# EAGLE design psu (EAGLE 6.5.0)
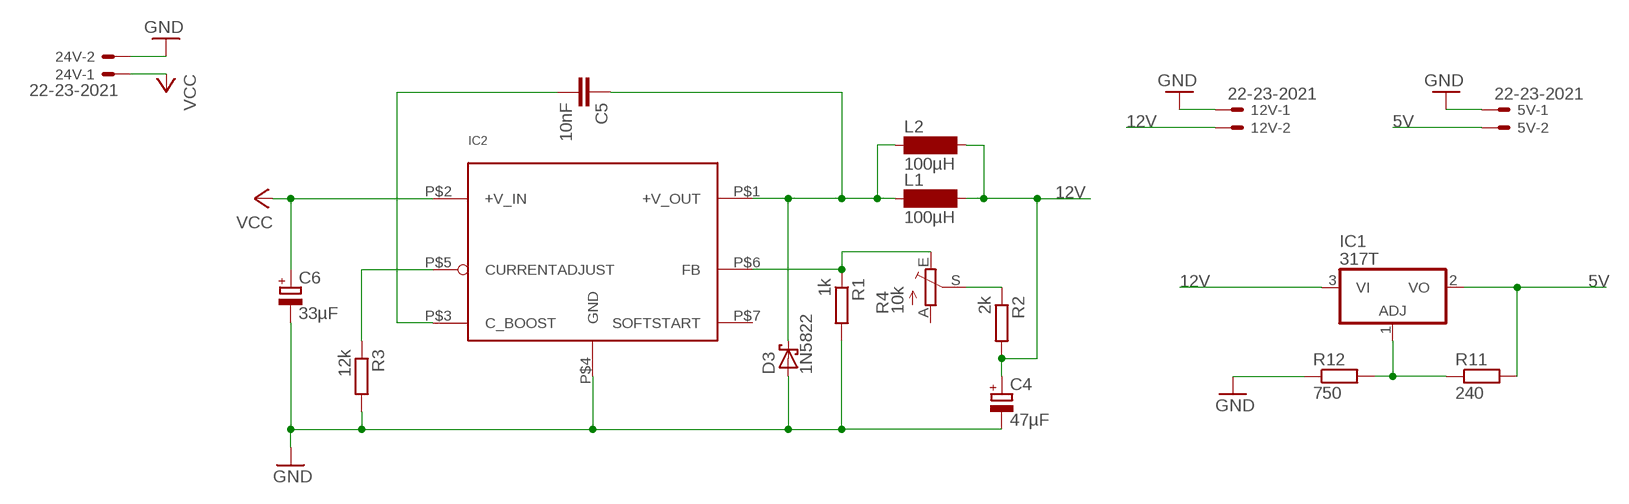
[diagram p0: schematic, sheet 1]

## Parts
5V  22-23-2021  [22-23-2021]
12V  22-23-2021  [22-23-2021]
24V  22-23-2021  [22-23-2021]
C4  47µF  CPOL-EUE2.5-5  [E2,5-5]
C5  10nF  C5/2.5  [C5B2.5]
C6  33µF  CPOL-EUE2.5-5  [E2,5-5]
D3  1N5822  1N5908  [C4111-15]
IC1  317T  [TO220H]
IC2  LM2576-T05D  [TO220-5_STAGGERED]
L1  100µH  SD75  [SD75]
L2  100µH  SD75  [SD75]
R1  1k  R-EU_0207/10  [0207/10]
R2  2k  R-EU_0207/10  [0207/10]
R3  12k  R-EU_0207/10  [0207/10]
R4  10k  TRIM_EU-B25P  [B25P]
R11  240  R-EU_0207/10  [0207/10]
R12  750  R-EU_0207/10  [0207/10]

## Nets
5V: 5V.2 IC1.2(VO) R11.2
12V: 12V.2 C4.+ IC1.3(VI) L1.2 L2.2 R2.2
GND: 5V.1 12V.1 24V.2 C4.- C6.- D3.A IC2.P$4(GND) R1.2 R3.2 R12.1
N$1: IC1.1(ADJ) R11.1 R12.2
N$2: R2.1 R4.S
N$4: IC2.P$6(FB) R1.1 R4.E
N$5: C5.2 IC2.P$3(C_BOOST)
N$6: C5.1 D3.C IC2.P$1(+V_OUT) L1.1 L2.1
N$7: IC2.P$5(CURRENTADJUST) R3.1
VCC: 24V.1 C6.+ IC2.P$2(+V_IN)
Unconnected: IC2.P$7(SOFTSTART) R4.A

## Library data of the parts
5V 12V 24V = con-molex:22-23-2021: .100" (2.54mm) Center Header - 2 Pin; MF: MOLEX; MPN: 22-23-2021; OC_FARNELL: 1462926; OC_NEWARK: 25C3832
C4 C6 = rcl:CPOL-EU: POLARIZED CAPACITOR, European symbol
C5 = capacitor-wima:C: CAPACITOR naming: grid - package width
D3 = diode:1N5908: DIODE schottky
IC1 = linear:*317: Positive VOLTAGE REGULATOR
IC2 = 2673:LM2576-T05D: LM2673/LM2673HV Series SIMPLE SWITCHER® 3A Step-Down Voltage Regulator STAGGERED PACKAGE
L1 L2 = inductor-neosid:SD75: INDUCTOR nominal inductance, E12; OC_FARNELL: unknown; OC_NEWARK: unknown
R1-R3 R11 R12 = rcl:R-EU_: RESISTOR, European symbol
R4 = pot:TRIM_EU-: POTENTIOMETER

## Board
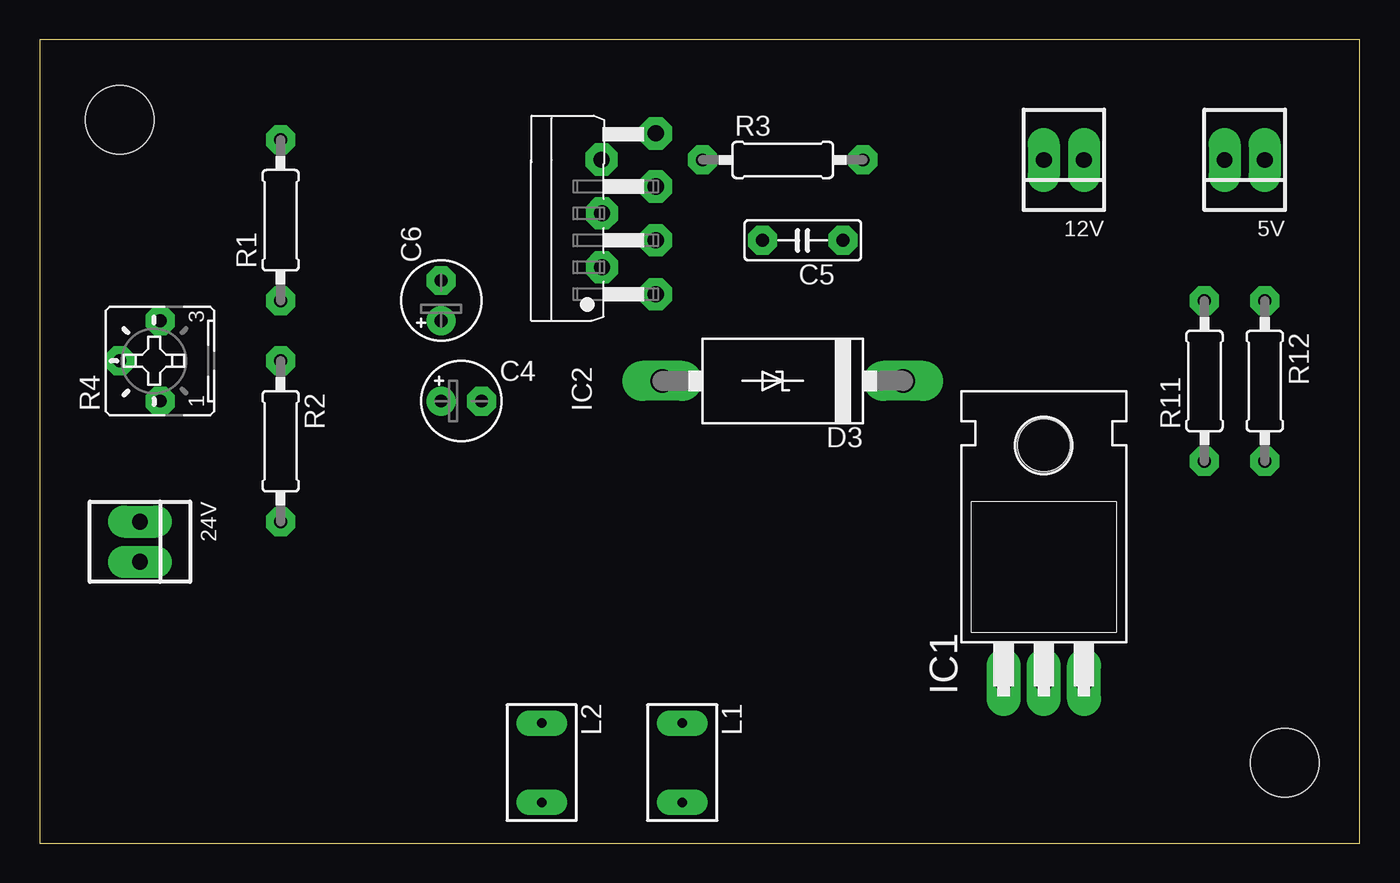
[diagram p1: board, top side]
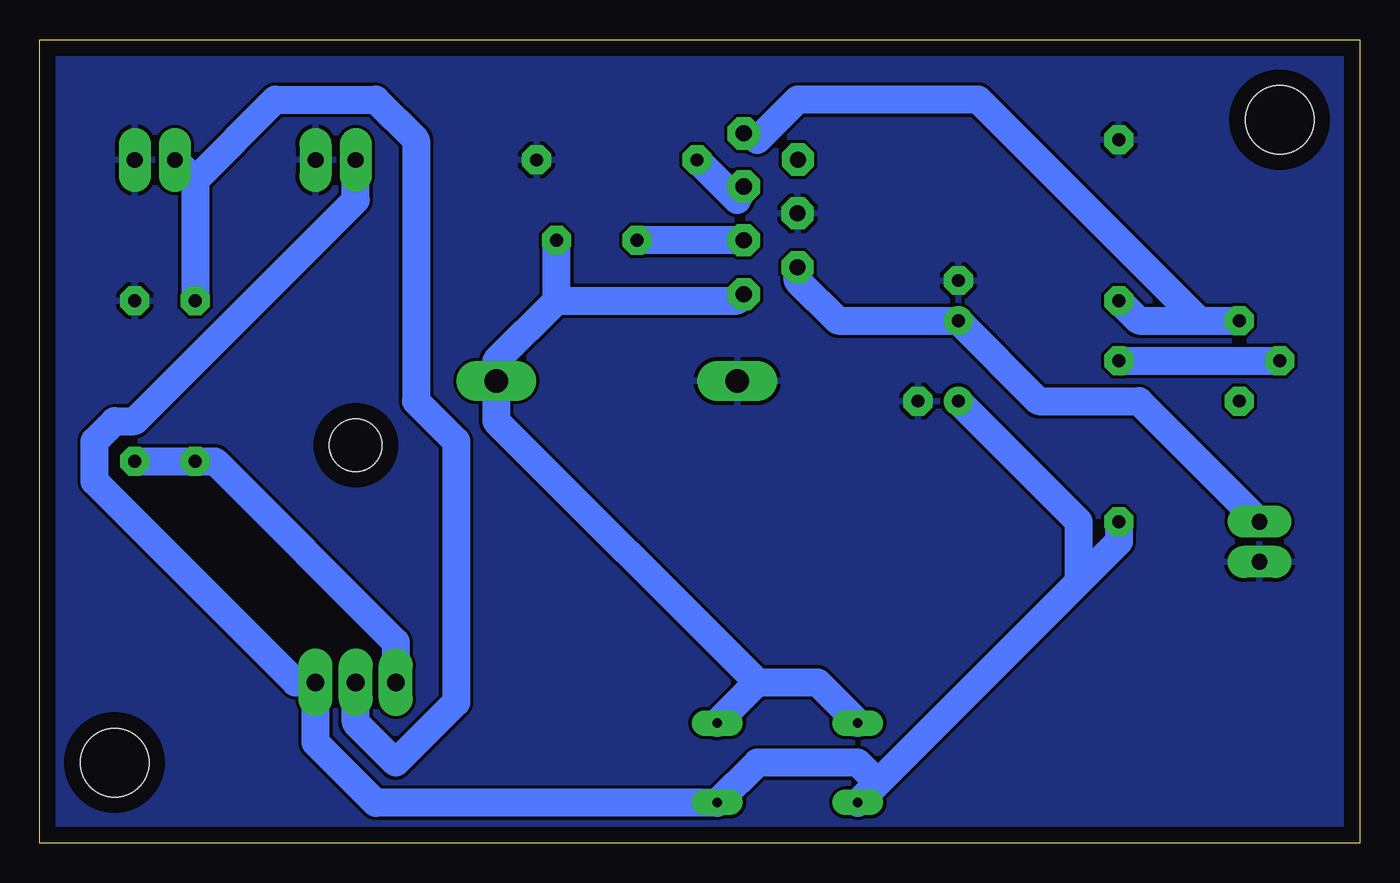
[diagram p2: board, bottom side, seen from below]

Size 83.49 x 50.79 mm. Coordinates in mm from the lower left corner, seen from the top.
Outline: 0,0 83.49,0 83.49,50.79 0,50.79 0,0
Copper layers (1*16): Top 0.035mm / dielectric 1.5mm / Bottom 0.035mm
Design rules "default *": minimum track width 70mil, minimum drill 24mil, track to track 8mil, track to pad 8mil, pad to pad 8mil, via to via 8mil, smd to smd 8mil, copper to edge 40mil, drill to drill 8mil, minimum pad ring 20mil, minimum via ring 8mil, stop-mask expansion 4mil, vias tented up to drill 0mil, thermal gap 10mil
Holes 4.32 mm at 5.08,45.72 78.74,5.08

### Footprints (pad centres in the part's own frame; a part is rotated, then mirrored left to right if it is on the bottom)
22-23-2021 = drill 1 long: 1 -1.27,0; 2 1.27,0
E2,5-5 = drill 0.813 pad 1.6: + -1.27,0 | drill 0.813 pad 1.6 octagon: - 1.27,0
C5B2.5 = drill 0.813 pad 1.6 octagon: 1 -2.54,0; 2 2.54,0
C4111-15 = drill 1.499 long: A 7.62,0; C -7.62,0
TO220H = drill 1.118 long: 1 -2.54,-10.16; 2 0,-10.16; 3 2.54,-10.16 | hole 3.302: 0,4.826
TO220-5_STAGGERED = drill 1.016 octagon: P$1 -3.404,-3.404; P$2 -1.702,0; P$3 0,-3.404; P$4 1.702,0; P$5 3.404,-3.404; P$6 6.756,-3.404; P$7 5.105,0.025
SD75 = drill 0.6 long: 1 -2.5,0; 2 2.5,0
0207/10 = drill 0.813 octagon: 1 -5.08,0; 2 5.08,0
B25P = drill 0.813 octagon: A -2.54,0; E 2.54,0; S 0,2.54

### Placement (x,y rotation side)
5V  76.2,43.18 180 top
12V  64.77,43.18 180 top
24V  6.35,19.05 270 top
C4  26.67,27.94 0 top
C5  48.26,38.1 180 top
C6  25.4,34.29 90 top
D3  46.99,29.21 180 top
IC1  63.5,20.32 0 top
IC2  35.56,38.1 90 top
L1  40.64,5.08 270 top
L2  31.75,5.08 270 top
R1  15.24,39.37 90 top
R2  15.24,25.4 270 top
R3  46.99,43.18 0 top
R4  7.62,30.48 90 top
R11  73.66,29.21 90 top
R12  77.47,29.21 270 top

### Tracks (layer width: path | path; a pad name or v marks a point on that pad's centre or on a via)
5V
  Bottom 1.778: 73.66,41.91 R11.2 | 5V.2 73.66,41.91 | IC1.2 63.5,7.62 60.96,5.08 57.15,8.89 57.15,25.4 59.69,27.94 59.69,44.45 62.23,46.99 68.58,46.99 73.66,41.91
12V
  Bottom 1.778: 12V.2 63.5,40.64 77.47,26.67 78.74,26.67 80.01,25.4 80.01,22.86 67.31,10.16 IC1.3 66.04,6.35 62.23,2.54 40.64,2.54 | 17.78,16.51 15.24,19.05 R2.2 | 17.78,16.51 30.48,3.81 | 30.48,3.81 31.75,2.54 L2.2 | 40.64,2.54 38.1,5.08 31.75,5.08 30.48,3.81 | C4.+ 17.78,20.32 17.78,16.51 | 40.64,2.54 L1.2
GND
  pour Bottom: 0,50.8 0,0 83.82,0 83.82,50.8
N$1
  Bottom 1.778: R12.2 R11.1 72.39,24.13 60.96,12.7 IC1.1
N$2
  Bottom 1.778: R2.1 R4.S
N$4
  Bottom 1.778: 10.16,33.02 13.97,33.02 R1.1 | 10.16,33.02 R4.E | 10.16,33.02 24.13,46.99 35.56,46.99 38.1,44.45 IC2.P$6
N$5
  Bottom 1.778: IC2.P$3 C5.2
N$6
  Bottom 1.778: 38.1,10.16 34.29,10.16 31.75,7.62 L2.1 | 38.1,10.16 40.64,7.62 L1.1 | 50.8,34.29 C5.1 | 50.8,34.29 54.61,30.48 D3.C 54.61,26.67 38.1,10.16 | 50.8,34.29 39.37,34.29 IC2.P$1
N$7
  Bottom 1.778: R3.1 39.37,40.64 IC2.P$5
VCC
  Bottom 1.778: IC2.P$2 35.56,35.56 33.02,33.02 C6.+ 20.32,27.94 13.97,27.94 24V.1